# Altium schematic sheet XEDIEUKHIEN.SchDoc
size A4; SheetNumber: 1; SheetTotal: 1
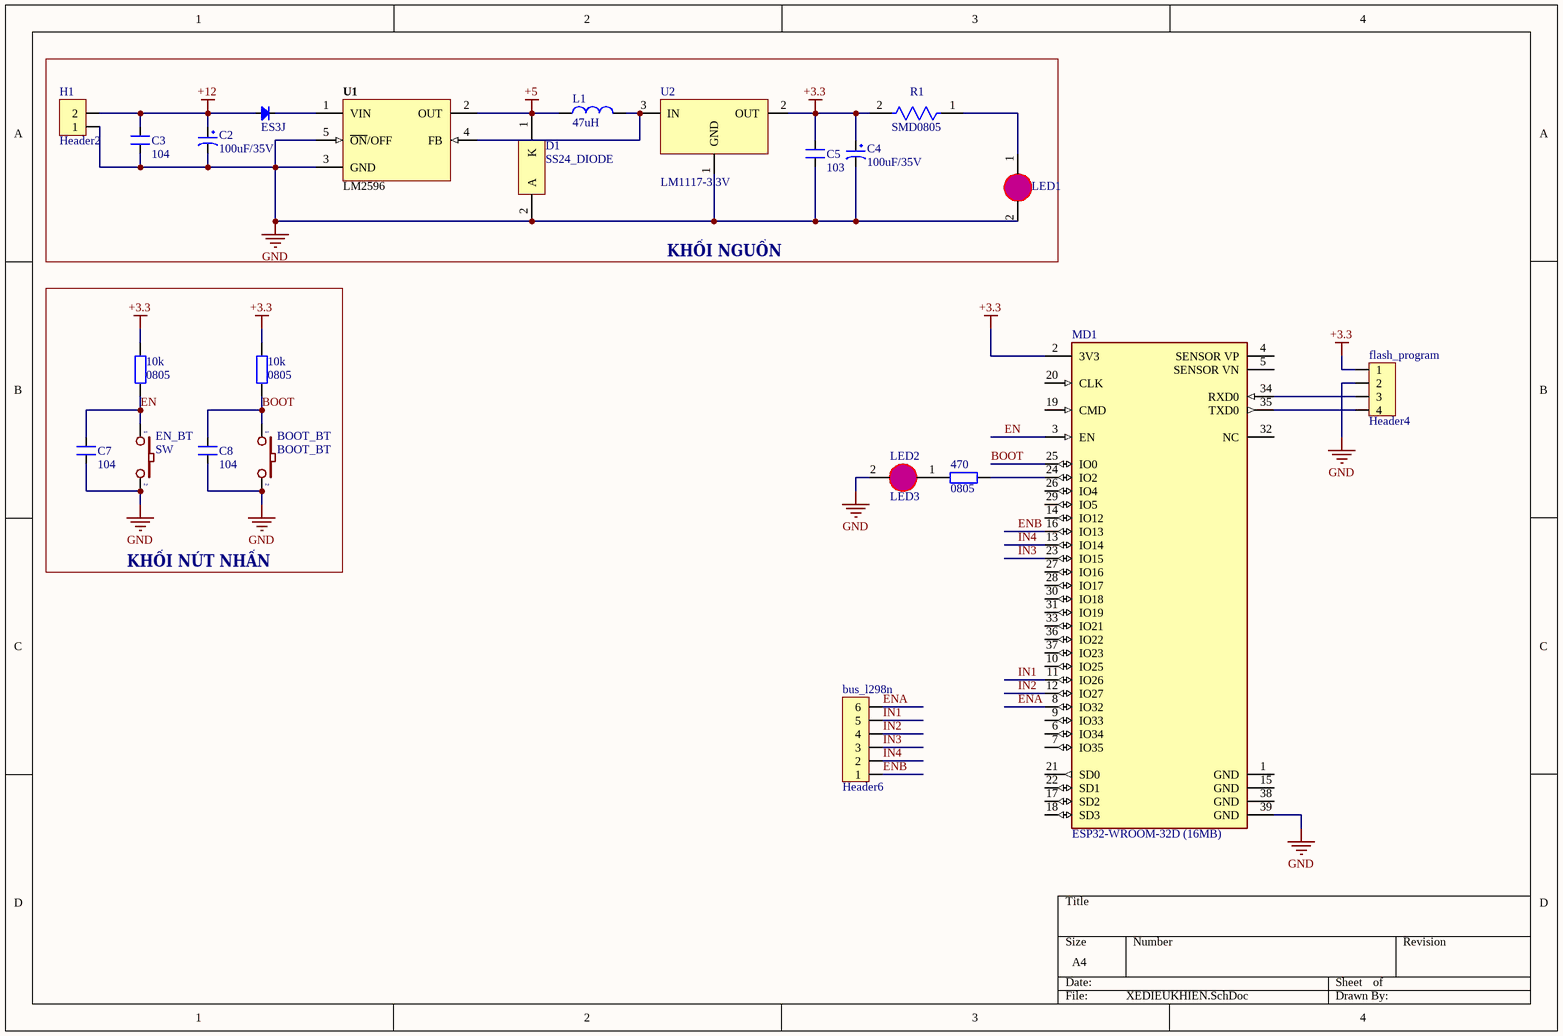
[diagram p0: XEDIEUKHIEN.SchDoc]

## Parts
(Parts that share a designator on the sheet are numbered #1, #2 ... from top to bottom, then left to right.)
10k#1  value 0805  [DIEN TRO 0805]  (hidden comment: R0805)
10k#2  value 0805  [DIEN TRO 0805]  (hidden comment: R0805)
470  value 0805  [DIEN TRO 0805]  (hidden comment: R0805)
BOOT_BT  BOOT_BT  [SW2]
bus_l298n  Header6  [HDR6]
C2  100uF/35V  [CP1.5/3.4]
C3  104  [CN2]
C4  100uF/35V  [CP1.5/3.4]
C5  103  [SM-0805]
C7  104  [SM-0805]
C8  104  [SM-0805]
D1  SS24_DIODE  [ONSC-SMB-2-403A-03_V]
EN_BT  SW  [SW2]
ES3J  Diode SMD  [DIO-SMD-106]  (value not drawn)
flash_program  Header4  [HDR4]
H1  Header2  [HDR2]
L1  47uH  [L/0.4]
LED1  (no value)  [LED0805]
LED2  LED3  [LED0805]
MD1  ESP32-WROOM-32D (16MB)  [FP-ESP32-WROOM-32D_16MB-MFG]
R1  SMD0805  [FP-AT0805-MFG]
U1  LM2596  [TO263]
U2  LM1117-3.3V  [SOT223]

## Blocks framed on the sheet
KHỐI NGUỒN: C2-C5 D1 ES3J H1 L1 LED1 R1 U1 U2
KHỐI NÚT NHẤN: 10k#1 10k#2 BOOT_BT C7 C8 EN_BT

## Nets
+3.3: 10k#1.2 10k#2.2 C4.1 C5.2 flash_program.1 MD1.2(3V3) R1.2 U2.2(OUT)
+5: D1.1(K) L1.1 U1.2(OUT)
+12: C2.1 C3.2 ES3J.1(A) H1.2
GND: BOOT_BT.2 C2.2 C3.1 C4.2 C5.1 C7.1 C8.1 D1.2(A) EN_BT.2 flash_program.2 H1.1 LED1.2(K) LED2.2(K) MD1.39(GND) U1.3(GND) U1.5(~{ON}/OFF) U2.1(GND)
BOOT: 10k#2.1 BOOT_BT.1 C8.2 MD1.25(IO0)
EN: 10k#1.1 C7.2 EN_BT.1 MD1.3(EN)
ENA: bus_l298n.6 MD1.8(IO32)
ENB: bus_l298n.1 MD1.16(IO13)
IN1: bus_l298n.5 MD1.11(IO26)
IN2: bus_l298n.4 MD1.12(IO27)
IN3: bus_l298n.3 MD1.23(IO15)
IN4: bus_l298n.2 MD1.13(IO14)
Net470_1: 470.1 LED2.1(A)
Net470_2: 470.2 MD1.24(IO2)
NetES3J_2: ES3J.2(K) U1.1(VIN)
Netflash_program_3: flash_program.3 MD1.34(RXD0)
Netflash_program_4: flash_program.4 MD1.35(TXD0)
NetL1_2: L1.2 U1.4(FB) U2.3(IN)
NetLED1_1: LED1.1(A) R1.1

Not connected (* = marked no-connect by the designer): MD1 1(GND) 4(SENSOR_VP) 5(SENSOR_VN) 6(IO34) 7(IO35) 9(IO33) 10(IO25) 14(IO12) 15(GND) 17(SD2) 18(SD3) 19(CMD) 20(CLK) 21(SD0) 22(SD1) 26(IO4) 27(IO16) 28(IO17) 29(IO5) 30(IO18) 31(IO19) 32(NC) 33(IO21) 36(IO22) 37(IO23) 38(GND)

## Library data of the parts
10k#1 10k#2 470 = R0805: Resistor SMD 0805; Published: 8-Jun-2000; LatestRevisionDate: 17-Jul-2002; LatestRevisionNote: Re-released for DXP Platform.; PackageReference: AXIAL-0.4; Publisher: Altium Limited
BOOT_BT EN_BT = SW2: Switch button 2 pin; Value: SW chip 2 pin
bus_l298n = Header6: Header IDC, 6 x 1 Pin Vertical 2.54mm Pitch (Non-Boxed, Male); Manufacturer: W¨¹rth Elektronik eiSos GmbH; partNo: 613002143121; ComponentLink1 Description: Manufacturer; ComponentLink2 Description: Datasheet; NoPins: 02; Created Date: 29 March 2013; ComponentLink1URL: http://www.we-online.com; ComponentLink2URL: http://katalog.we-online.de/em/datasheet/6130xx143121.pdf; Created by: Karrer Zheng
C2 C4 = CP3: Cap 100uF/35V - 470uF/16V; Value: 100uF/35V/50V; Description 1: 1000uF/6,3V - 470uF/16V - 330uF - 25V; Description 2: 220uF/35V - 100uF/50V - 63V - 4,7uF/200V; Description 3: 22uF => 33uF100V - 3,3uF => 4,7uF/250V; Description 4: 2,2uF =>3,3uF/350 - 2,2uF/400V - 1uF/450V
C3 = CN2: Cap np 104 => 105pF; Value: 0.1uF
C5 = CM: Cap SMD; Value: 103
C7 C8 = CM: Cap SMD; Value: 103
D1 = CMP-1055-00372-1: Schottky Power Rectifier, 2-Pin SMB, Pb-Free, Tape and Reel; Manufacturer: On Semiconductor; PartNumber: SS24T3G; IFSM Max (A): 75; Configuration: Single; ComponentLink3Description: Package Specification; PackageReference: SMB-2-403A-03; ComponentLink2URL: http://www.onsemi.cn/pub_link/Collateral/SS24-D.PDF; PackageVersion: Rev. J, 07/2012; PackageDescription: 2-Pin Small Molded Package, J-Bend Lead, Body 4.33 x 3.625 mm; ComponentLink1Description: Manufacturer URL; ComponentLink1URL: http://www.onsemi.com/; RoHS: TRUE; ComponentLink2Description: Datasheet; Packing: Tape and Reel; Mounting Technology: Surface Mount; ComponentLink3URL: http://www.onsemi.com/pub_link/Collateral/403A-03.PDF; DatasheetVersion: Rev. 4
ES3J = Diode SMD: Default Diode; Code - JEDEC: DO-214-AB; Value: 1N5007; Published: 8-Jun-2000; Revision: July-2002: Re-released for DXP Platform.; Publisher: Altium Limited
flash_program = Header4: Header IDC, 4 x 1 Pin Vertical 2.54mm Pitch (Non-Boxed, Male); Manufacturer: W¨¹rth Elektronik eiSos GmbH; partNo: 613002143121; ComponentLink1 Description: Manufacturer; ComponentLink2 Description: Datasheet; NoPins: 02; Created Date: 29 March 2013; ComponentLink1URL: http://www.we-online.com; ComponentLink2URL: http://katalog.we-online.de/em/datasheet/6130xx143121.pdf; Created by: Karrer Zheng
H1 = Header2: Header IDC, 2 x 1 Pin Vertical 2.54mm Pitch (Non-Boxed, Male); Manufacturer: W¨¹rth Elektronik eiSos GmbH; partNo: 613002143121; ComponentLink1 Description: Manufacturer; ComponentLink2 Description: Datasheet; NoPins: 02; Created Date: 29 March 2013; ComponentLink1URL: http://www.we-online.com; ComponentLink2URL: http://katalog.we-online.de/em/datasheet/6130xx143121.pdf; Created by: Karrer Zheng
L1 = L1: Inductor; Value: 150 mH
LED1 LED2 = LED0805: LED SMD 0805
MD1 = CMP-194065-000022-1: RX TXRX MOD WIFI TRACE ANT SMD; Data Rate: 150Mbps; Memory Size: 536KB; Interface: I2C; Frequency: 2.5GHz; Sensitivity: -98dBm; Packaging: Tape and Reel; Min Operating Temperature: -40°C; Max Operating Temperature: 85°C; Mount: Surface Mount; Case/Package: SMD/SMT
R1 = CMP-03412-024763-2: Thin Film Chip Resistors Automotive Grade 100kΩ 1% 50ppm/°C 0805; RoHS Compliant: Yes
U1 = LM2596: Max Input Voltage: 12 V; Max Output Current: 3 (6.0 peak) A; Max Output Voltage: mV; Category: IC-Power; Min Input Voltage: mV; Min Output Voltage: mV; Mounting Technology: Surface Mount; Status: Unreleased; Supply Voltage: mV; Temperature Range: -40 to +125 degC
U2 = LM1117_1: 800mA Low-Dropout Linear Regulator; Creator: Nguyen Ba Bien; Website: http://group3i.net